# Altium schematic sheet Main.SchDoc
size A4; SheetNumber: 1; SheetTotal: 15
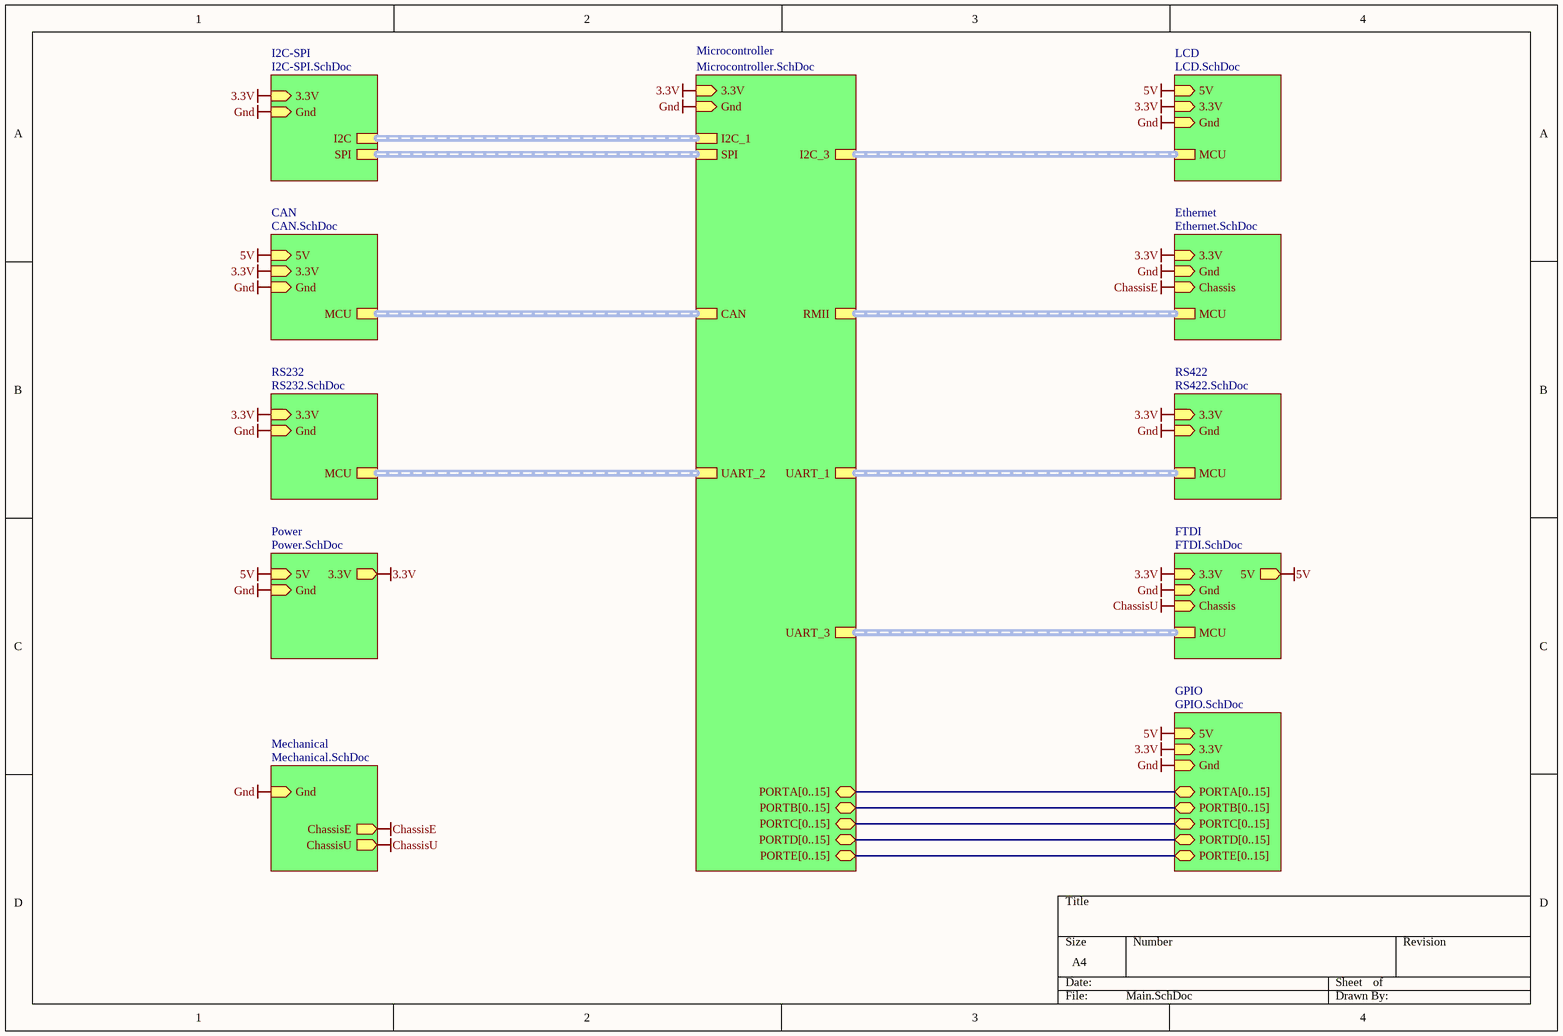
[diagram p0: Main.SchDoc]

## Sub-sheets
CAN = CAN.SchDoc: 3.3V (in), Gnd (in), MCU (harness CAN), 5V (in)
Ethernet = Ethernet.SchDoc: 3.3V (in), Gnd (in), MCU (harness RMII), Chassis (in)
FTDI = FTDI.SchDoc: 3.3V (in), Gnd (in), MCU (harness UART), 5V (out), Chassis (in)
GPIO = GPIO.SchDoc: 3.3V (in), Gnd (in), PORTA[0..15] (bidir), PORTB[0..15] (bidir), PORTC[0..15] (bidir), PORTD[0..15] (bidir), PORTE[0..15] (bidir), 5V (in)
I2C-SPI = I2C-SPI.SchDoc: 3.3V (in), Gnd (in), I2C (harness I2C), SPI (harness SPI)
LCD = LCD.SchDoc: 3.3V (in), Gnd (in), MCU (harness I2C), 5V (in)
Mechanical = Mechanical.SchDoc: ChassisU (out), Gnd (in), ChassisE (out)
Microcontroller = Microcontroller.SchDoc: I2C_3 (harness I2C), I2C_1 (harness I2C), UART_3 (harness UART), UART_1 (harness UART), UART_2 (harness UART), RMII (harness RMII), CAN (harness CAN), PORTA[0..15] (bidir), PORTB[0..15] (bidir), PORTC[0..15] (bidir), PORTD[0..15] (bidir), PORTE[0..15] (bidir), 3.3V (in), Gnd (in), SPI (harness SPI)
Power = Power.SchDoc: 5V (in), Gnd (in), 3.3V (out)
RS232 = RS232.SchDoc: 3.3V (in), Gnd (in), MCU (harness UART)
RS422 = RS422.SchDoc: 3.3V (in), Gnd (in), MCU (harness UART)

## Nets
3.3V: sheet Microcontroller/3.3V, sheet LCD/3.3V, sheet FTDI/3.3V, sheet Power/3.3V, sheet GPIO/3.3V, sheet Ethernet/3.3V, sheet RS422/3.3V, sheet RS232/3.3V, sheet CAN/3.3V, sheet I2C-SPI/3.3V
5V: sheet LCD/5V, sheet FTDI/5V, sheet Power/5V, sheet GPIO/5V, sheet CAN/5V
ChassisE: sheet Ethernet/Chassis, sheet Mechanical/ChassisE
ChassisU: sheet FTDI/Chassis, sheet Mechanical/ChassisU
Gnd: sheet Microcontroller/Gnd, sheet LCD/Gnd, sheet FTDI/Gnd, sheet Power/Gnd, sheet GPIO/Gnd, sheet Ethernet/Gnd, sheet RS422/Gnd, sheet RS232/Gnd, sheet CAN/Gnd, sheet Mechanical/Gnd, sheet I2C-SPI/Gnd

## Buses and harness runs
bus sheet GPIO/PORTA[0..15] = sheet Microcontroller/PORTA[0..15]
bus sheet GPIO/PORTB[0..15] = sheet Microcontroller/PORTB[0..15]
bus sheet GPIO/PORTC[0..15] = sheet Microcontroller/PORTC[0..15]
bus sheet GPIO/PORTD[0..15] = sheet Microcontroller/PORTD[0..15]
bus sheet GPIO/PORTE[0..15] = sheet Microcontroller/PORTE[0..15]
harness sheet CAN/MCU = sheet Microcontroller/CAN
harness sheet Ethernet/MCU = sheet Microcontroller/RMII
harness sheet FTDI/MCU = sheet Microcontroller/UART_3
harness sheet I2C-SPI/I2C = sheet Microcontroller/I2C_1
harness sheet I2C-SPI/SPI = sheet Microcontroller/SPI
harness sheet LCD/MCU = sheet Microcontroller/I2C_3
harness sheet Microcontroller/UART_1 = sheet RS422/MCU
harness sheet Microcontroller/UART_2 = sheet RS232/MCU